# Altium schematic sheet Microcontroller.SchDoc: Microcontroller Schematic
size A; Author: Jason Popich; DocumentNumber: N/A; Revision: 001; SheetNumber: 2; SheetTotal: 4
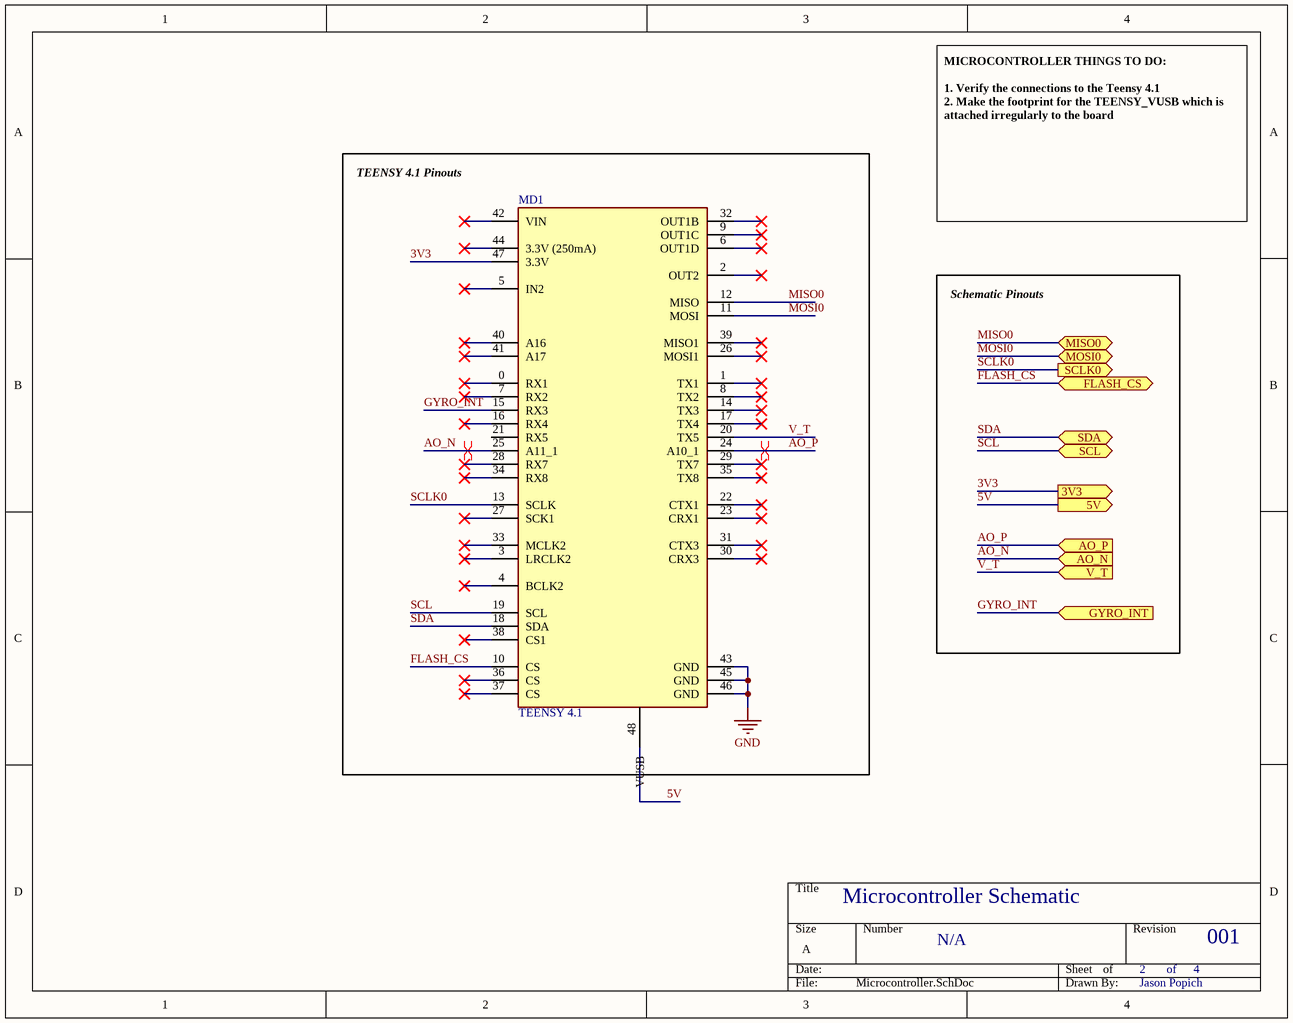
[diagram p0: Microcontroller.SchDoc]

## Parts
MD1  TEENSY 4.1  [Teensy4_1]

## Blocks framed on the sheet
TEENSY 4.1 Pinouts: MD1

## Ports
3V3 (out, see Main_Sheet[2B], Accelerometer[3B], Gyroscope[4B]), 5V (out, see Main_Sheet[2B], Accelerometer[3B]), AO_N (in, see Main_Sheet[2C], Accelerometer[3B]), AO_P (in, see Main_Sheet[2C], Accelerometer[3B]), FLASH_CS (bidir, see Main_Sheet[2C]), GYRO_INT (in, see Main_Sheet[2B]), MISO0 (bidir, see Main_Sheet[2C]), MOSI0 (bidir, see Main_Sheet[2C]), SCL (bidir, see Main_Sheet[2B], Gyroscope[4B]), SCLK0 (out, see Main_Sheet[2C]), SDA (bidir, see Main_Sheet[2B], Gyroscope[4B]), V_T (in, see Main_Sheet[2C], Accelerometer[3B])

## Nets
GND: MD1.43(GND) MD1.45(GND) MD1.46(GND)
3V3: MD1.47(3.3V) ; port 3V3
5V: port 5V
AO_N: MD1.25(A11_1) ; port AO_N
AO_P: MD1.24(A10_1) ; port AO_P
FLASH_CS: MD1.10(CS) ; port FLASH_CS
GYRO_INT: MD1.15(RX3) ; port GYRO_INT
MISO0: MD1.12(MISO) ; port MISO0
MOSI0: MD1.11(MOSI) ; port MOSI0
SCL: MD1.19(SCL) ; port SCL
SCLK0: MD1.13(SCLK) ; port SCLK0
SDA: MD1.18(SDA) ; port SDA
V_T: MD1.20(TX5) ; port V_T

Not connected (* = marked no-connect by the designer): MD1 0(RX1)* 1(TX1)* 2(OUT2)* 3(LRCLK2)* 4(BCLK2)* 5(IN2)* 6(OUT1D)* 7(RX2)* 8(TX2)* 9(OUT1C)* 14(TX3)* 16(RX4)* 17(TX4)* 21(RX5) 22(CTX1)* 23(CRX1)* 26(MOSI1)* 27(SCK1)* 28(RX7)* 29(TX7)* 30(CRX3)* 31(CTX3)* 32(OUT1B)* 33(MCLK2)* 34(RX8)* 35(TX8)* 36(CS)* 37(CS)* 38(CS1)* 39(MISO1)* 40(A16)* 41(A17)* 42(VIN)* 44(3.3V_(250mA))* 48(VUSB)

## Layout directives
differential pair: AO_N, AO_P

## Notes on the sheet
- MICROCONTROLLER THINGS TO DO:
  1. Verify the connections to the Teensy 4.1
  2. Make the footprint for the TEENSY_VUSB which is attached irregularly to the board
- Schematic Pinouts
- of

## Library data of the parts
MD1 = 080115a1ce54750370cf87ec145ee29: TEENSY 4.1 (HEADERS)